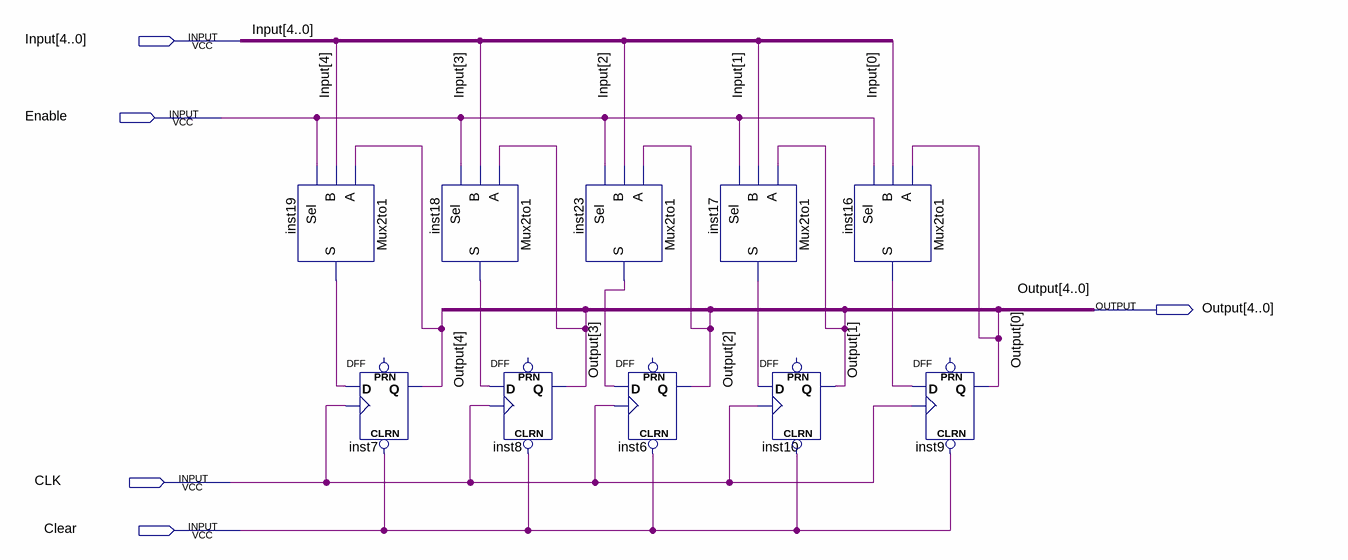
[diagram p0: schematic sheet]
// Quartus schematic ADDR.bdf as structural Verilog: 10 symbols, 5 pins
module ADDR (
  input  [4:0] Input,
  input  Enable,
  input  CLK,
  input  Clear,
  output [4:0] Output
);

  wire inst16_s, inst17_s, inst18_s, inst19_s, inst23_s;

  Mux2to1 inst19 (.A(Output[4]), .B(Input[4]), .Sel(Enable), .S(inst19_s));
  DFF inst7 (.CLRN(Clear), .CLK(CLK), .D(inst19_s), .Q(Output[4]));  // open: PRN
  Mux2to1 inst18 (.A(Output[3]), .B(Input[3]), .Sel(Enable), .S(inst18_s));
  DFF inst8 (.CLRN(Clear), .CLK(CLK), .D(inst18_s), .Q(Output[3]));  // open: PRN
  Mux2to1 inst23 (.A(Output[2]), .B(Input[2]), .Sel(Enable), .S(inst23_s));
  DFF inst6 (.CLRN(Clear), .CLK(CLK), .D(inst23_s), .Q(Output[2]));  // open: PRN
  Mux2to1 inst17 (.A(Output[1]), .B(Input[1]), .Sel(Enable), .S(inst17_s));
  DFF inst10 (.CLRN(Clear), .CLK(CLK), .D(inst17_s), .Q(Output[1]));  // open: PRN
  Mux2to1 inst16 (.A(Output[0]), .B(Input[0]), .Sel(Enable), .S(inst16_s));
  DFF inst9 (.CLRN(Clear), .CLK(CLK), .D(inst16_s), .Q(Output[0]));  // open: PRN
endmodule
